# Altium schematic sheet zs-pentagon-dip_4.SchDoc
size A4
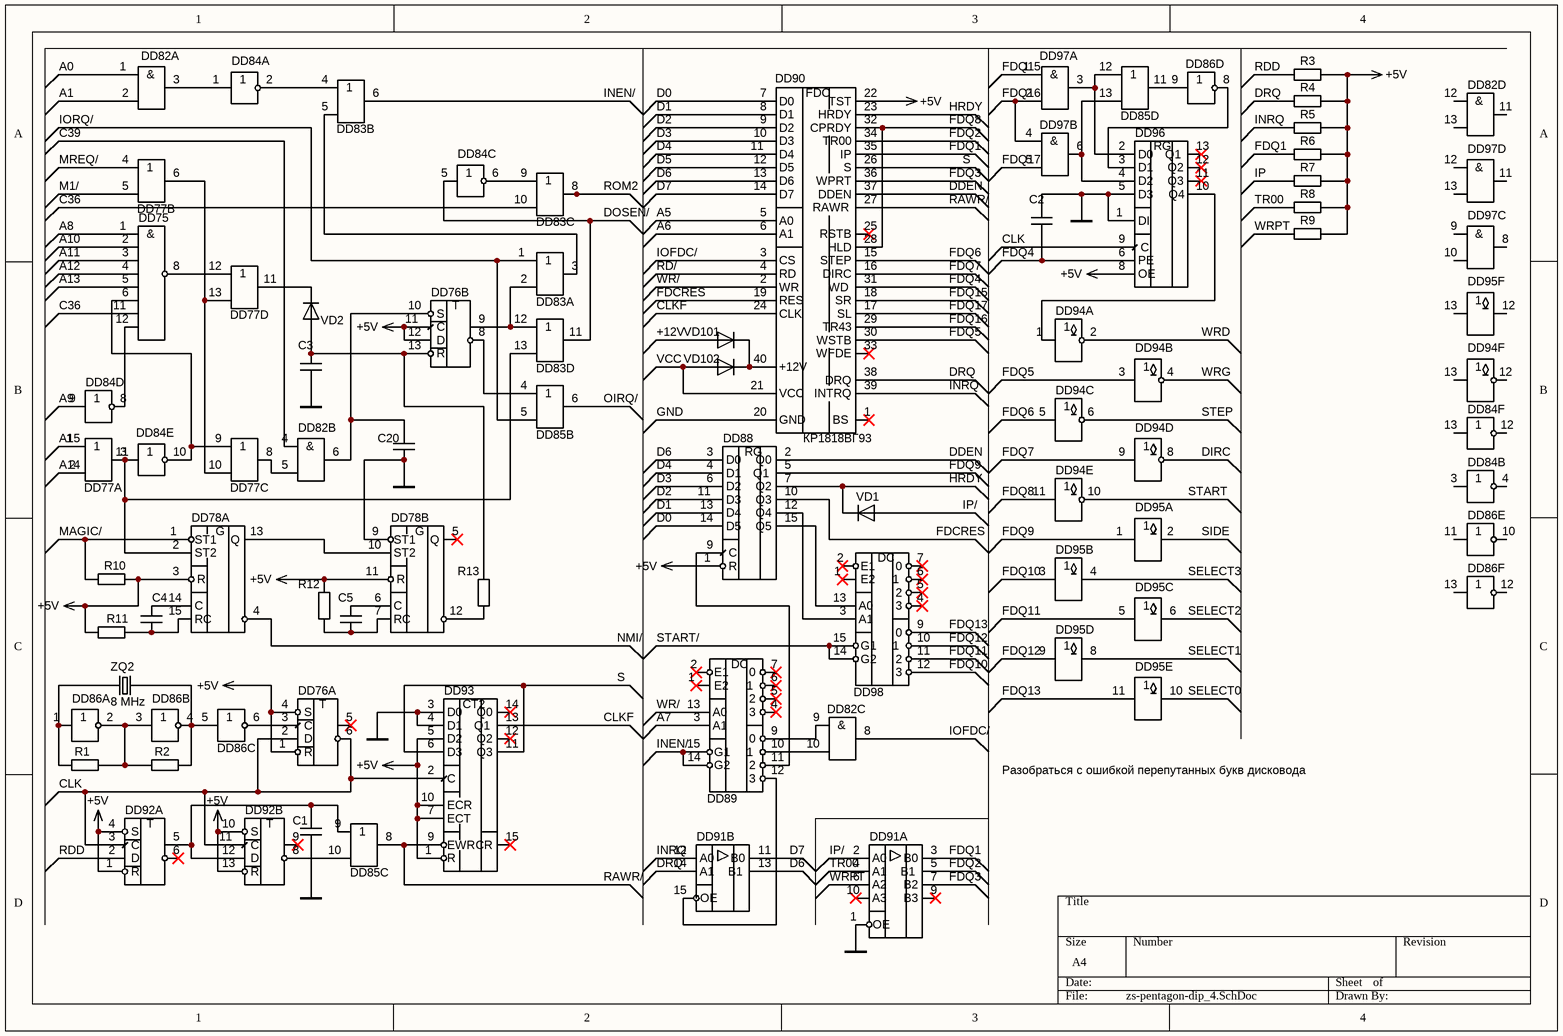
[diagram p0: zs-pentagon-dip_4.SchDoc]

## Parts
C1  220 пФ  [C0805]  (value not drawn)
C2  100 пФ  [C0805]  (value not drawn)
C3  200 пФ  [C0805]  (value not drawn)
C4  1 мкФ  [C0805]  (value not drawn)
C5  750 пФ  [C0805]  (value not drawn)
C20  270 пФ  [C0805]  (value not drawn)
DD75  КР1533ЛA2  [DIP14]  (value not drawn)
DD76  КР1533ТМ2  [DIP14]  (value not drawn)  (parts A,B of 2)
DD77  КР1533ЛЛ1  [DIP14]  (value not drawn)  (parts A,B,C,D of 4)
DD78  КР1533АГ3  [DIP16]  (value not drawn)  (parts A,B of 2)
DD82  КР1533ЛИ1  [DIP14]  (value not drawn)  (parts A,B,C,D of 4)
DD83  КР1533ЛЛ1  [DIP14]  (value not drawn)  (parts A,B,C,D of 4)
DD84  КР1533ЛН1  [DIP14]  (value not drawn)  (parts A,B,C,D,E,F of 6)
DD85  КР1533ЛЛ1  [DIP14]  (value not drawn)  (parts B,C,D of 4)
DD86  КР1533ЛН1  [DIP14]  (value not drawn)  (parts A,B,C,D,E,F of 6)
DD88  КР1533ТМ9  [DIP16]  (value not drawn)
DD89  КР1533ИД4  [DIP16]  (value not drawn)
DD90  КР1818ВГ93  [KR1818VG93]
DD91  КР1533ЛП11  [DIP16]  (value not drawn)  (parts A,B of 2)
DD92  КР1533ТМ2  [DIP14]  (value not drawn)  (parts A,B of 2)
DD93  КР1533ИЕ10  [DIP16]  (value not drawn)
DD94  КР1533ЛН2  [DIP14]  (value not drawn)  (parts A,B,C,D,E,F of 6)
DD95  К155ЛП9  [DIP14]  (value not drawn)  (parts A,B,C,D,E,F of 6)
DD96  К555ИР16  [DIP14]  (value not drawn)
DD97  КР1533ЛИ1  [DIP14]  (value not drawn)  (parts A,B,C,D of 4)
DD98  КР1533ИД4  [DIP16]  (value not drawn)
R1  510 Ом  [R0603]  (value not drawn)  (no BOM)
R2  510 Ом  [R0603]  (value not drawn)  (no BOM)
R3  10 кОм  [R0603]  (value not drawn)  (no BOM)
R4  10 кОм  [R0603]  (value not drawn)  (no BOM)
R5  10 кОм  [R0603]  (value not drawn)  (no BOM)
R6  10 кОм  [R0603]  (value not drawn)  (no BOM)
R7  1 кОм  [R0603]  (value not drawn)  (no BOM)
R8  1 кОм  [R0603]  (value not drawn)  (no BOM)
R9  1 кОм  [R0603]  (value not drawn)  (no BOM)
R10  1 кОм  [R0603]  (value not drawn)  (no BOM)
R11  1 кОм  [R0603]  (value not drawn)  (no BOM)
R12  18 кОм  [R0603]  (value not drawn)  (no BOM)
R13  470 Ом  [R0603]  (value not drawn)  (no BOM)
VD1  1N4148W  [SODFL1608X70N]  (value not drawn)
VD2  1N4148W  [SODFL1608X70N]  (value not drawn)
VD101  1N4148W  [SODFL1608X70N]  (value not drawn)
VD102  1N4148W  [SODFL1608X70N]  (value not drawn)
ZQ2  8 MHz  [XTAL_HC-49U]

## Nets
+5V: DD76.1(R) DD76.4(S) DD76.11(C) DD76.12(D) DD78.3(R) DD78.11(R) DD88.1(R) DD90.22(TST) DD92.1(R) DD92.4(S) DD92.10(S) DD92.13(R) DD93.1(R) DD93.5(D2) DD93.7(ECT) DD93.10(ECR) DD96.8(OE) R3.1 R4.1 R5.1 R6.1 R7.1 R8.1 R9.1 R10.1 R11.2 R12.2
GND: C1.1 C2.2 C3.1 C20.1 DD75.7(GND) DD76.7(GND) DD78.8(GND) DD78.9(ST1) DD82.7(GND) DD84.7(GND) DD86.7(GND) DD88.8(GND) DD90.20(GND) DD91.1(OE) DD91.8(GND) DD92.7(GND) DD93.3(D0) DD93.4(D1) DD93.8(GND) DD94.7(GND) DD95.7(GND) DD96.1(DI) DD96.5(D3) DD96.7(GND) DD97.7(GND)
VCC: DD75.14(VCC) DD76.14(VCC) DD78.16(VCC) DD82.14(VCC) DD84.14(VCC) DD86.14(VCC) DD88.16(VCC) DD90.21(VCC) DD91.16(VCC) DD92.14(VCC) DD93.16(VCC) DD94.14(VCC) DD95.14(VCC) DD96.14(VCC) DD97.14(VCC) VD102.A
+12V: VD101.A
A0: DD82.1
A1: DD82.2
A5: DD90.5(A0)
A6: DD90.6(A1)
A7: DD89.3(A1)
A8: DD75.1
A9: DD84.9
A10: DD75.2
A11: DD75.3
A12: DD75.4
A13: DD75.5
A14: DD77.2
A15: DD77.1
C36: DD75.11 DD83.10
C39: DD82.4
CLK: DD76.2(D) DD76.6 DD92.3(C) DD92.11(C) DD93.2(C) DD96.9(C)
CLKF: DD90.24(CLK) DD93.13(Q1)
D0: DD88.14(D5) DD90.7(D0)
D1: DD88.13(D4) DD90.8(D1)
D2: DD88.11(D3) DD90.9(D2)
D3: DD88.6(D2) DD90.10(D3)
D4: DD88.4(D1) DD90.11(D4)
D5: DD90.12(D5)
D6: DD88.3(D0) DD90.13(D6) DD91.13(B1)
D7: DD90.14(D7) DD91.11(B0)
DDEN: DD88.2(Q0) DD90.37(DDEN)
DIRC: DD94.8
DOSEN/: DD83.11 DD84.5
DRQ: DD90.38(DRQ) DD91.14(A1) R4.2
FDCRES: DD88.10(Q3) DD90.19(RES)
FDQ1: DD90.35(IP) DD91.3(B0) R6.2
FDQ2: DD90.34(TR00) DD91.5(B1)
FDQ3: DD90.36(WPRT) DD91.7(B2)
FDQ4: C2.1 DD90.31(WD) DD96.6(PE)
FDQ5: DD90.30(WSTB) DD94.3
FDQ6: DD90.15(STEP) DD94.5
FDQ7: DD90.16(DIRC) DD94.9
FDQ8: DD90.28(HLD) DD90.32(CPRDY) DD94.11
FDQ9: DD88.5(Q1) DD95.1
FDQ10: DD95.3 DD98.12(3)
FDQ11: DD95.5 DD98.11(2)
FDQ12: DD95.9 DD98.10(1)
FDQ13: DD95.11 DD98.9(0)
FDQ15: DD90.18(SR) DD97.1
FDQ16: DD90.29(TR43) DD97.2 DD97.4
FDQ17: DD90.17(SL) DD97.5
HRDY: DD88.7(Q2) DD90.23(HRDY) VD1.C
INEN/: DD83.6 DD89.14(G2) DD89.15(G1)
INRQ: DD90.39(INTRQ) DD91.12(A0) R5.2
IOFDC/: DD82.8 DD90.3(CS)
IORQ/: DD83.1 DD85.5
IP: R7.2
IP/: DD91.2(A0) VD1.A
M1/: DD77.5
MAGIC/: DD78.1(ST1) R10.2
MREQ/: DD77.4
NMI/: DD78.4
OIRQ/: DD85.6
RAWR/: DD85.8 DD90.27(RAWR) DD93.9(EWR)
RD/: DD90.4(RD)
RDD: DD92.2(D) R3.2
ROM2: DD83.8
S: DD90.26(S) DD93.6(D3) DD93.11(Q3)
SELECT0: DD95.10
SELECT1: DD95.8
SELECT2: DD95.6
SELECT3: DD95.4
SIDE: DD95.2
START: DD94.10
START/: DD98.14(G2) DD98.15(G1)
STEP: DD94.6
TR00: DD91.4(A1) R8.2
WR/: DD89.13(A0) DD90.2(WR)
WRD: DD94.2
WRG: DD94.4
WRPT: DD91.6(A2) R9.2
NetC1_2: C1.2 DD85.9 DD92.5 DD92.12(D)
NetC3_2: C3.2 DD76.13(R) R13.2 VD2.A
NetC4_1: C4.1 DD78.15(RC) R11.1
NetC4_2: C4.2 DD78.14(C)
NetC5_1: C5.1 DD78.7(RC) R12.1
NetC5_2: C5.2 DD78.6(C)
NetC20_2: C20.2 DD76.10(S) DD82.6
NetDD75_6: DD75.6 DD77.9 DD84.10
NetDD75_8: DD75.8 DD77.12
NetDD75_12: DD75.12 DD84.8
NetDD76_3: DD76.3(C) DD86.6
NetDD76_8: DD76.8 DD85.4
NetDD76_9: DD76.9 DD83.2 DD83.12
NetDD77_3: DD77.3 DD78.2(ST2) DD83.13 DD84.11
NetDD77_6: DD77.6 DD77.10 DD77.13
NetDD77_8: DD77.8 DD82.5
NetDD77_11: DD77.11 VD2.C
NetDD78_10: DD78.10(ST2) DD78.13(Q)
NetDD78_12: DD78.12 R13.1
NetDD82_3: DD82.3 DD84.1
NetDD82_9: DD82.9 DD89.9(0)
NetDD82_10: DD82.10 DD89.10(1)
NetDD83_3: DD83.3 DD83.5
NetDD83_4: DD83.4 DD84.2
NetDD83_9: DD83.9 DD84.6
NetDD85_10: DD85.10 DD92.8
NetDD85_11: DD85.11 DD86.9
NetDD85_12: DD85.12 DD96.2(D0) DD97.3
NetDD85_13: DD85.13 DD96.4(D2) DD97.6
NetDD86_1: DD86.1 R1.2 ZQ2.1
NetDD86_2: DD86.2 DD86.3 R1.1 R2.2
NetDD86_4: DD86.4 DD86.5 R2.1 ZQ2.2
NetDD86_8: DD86.8 DD96.3(D1)
NetDD88_9: DD88.9(C) DD89.11(2)
NetDD88_12: DD88.12(Q4) DD98.3(A1)
NetDD88_15: DD88.15(Q5) DD98.13(A0)
NetDD89_12: DD89.12(3) DD91.15(OE)
NetDD90_40: DD90.40(+12V) VD101.C VD102.C
NetDD94_1: DD94.1 DD96.10(Q4)

Not connected (* = marked no-connect by the designer): DD76 5*; DD77 7(GND) 14(VCC); DD78 5(Q)*; DD82 11 12 13; DD83 7(GND) 14(VCC); DD84 3 4 12 13; DD86 10 11 12 13; DD89 1(E2)* 2(E1)* 4(3)* 5(2)* 6(1)* 7(0)* 8(GND) 16(VCC); DD90 1(BS)* 25(RSTB)* 33(WFDE)*; DD91 9(B3)* 10(A3)*; DD92 6* 9*; DD93 12(Q2)* 14(Q0)* 15(CR)*; DD94 12 13; DD95 12 13; DD96 11(Q3)* 12(Q2)* 13(Q1)*; DD97 8 9 10 11 12 13; DD98 1(E2)* 2(E1)* 4(3)* 5(2)* 6(1)* 7(0)* 8(GND) 16(VCC)

## Notes on the sheet
- Разобраться с ошибкой перепутанных букв дисковода
- (in symbol К555ИР16) RG
- (in symbol КР1533АГ3, part A) G
- (in symbol КР1533АГ3, part B) G
- (in symbol КР1533ИД4) DC
- (in symbol КР1533ИЕ10) CT2
- (in symbol КР1533ЛA2) &
- (in symbol КР1533ЛИ1, part A) &
- (in symbol КР1533ЛИ1, part B) &
- (in symbol КР1533ЛИ1, part C) &
- (in symbol КР1533ЛИ1, part D) &
- (in symbol КР1533ТМ2, part A) Т
- (in symbol КР1533ТМ2, part B) Т
- (in symbol КР1533ТМ9) RG
- (in symbol КР1818ВГ93) FDC

## Library data of the parts
C1-C5 C20 = CapCer
R1-R13 = Res
ZQ2 = HC-49U_8M